# Altium schematic sheet Car.SchDoc: Car
size 431 x 279 mm; Date: Not shown in title block; ApprovedBy: Not shown in title block; CheckedBy: Not shown in title block; Author: Not shown in title block; CompanyName: Not shown in title block; Engineer: Not shown in title block; Organization: loganhartfordprojects.com; Revision: 0.1; PageSetup: Record=PageOptions|CenterHorizontal=True|CenterVertical=True|PrintScale=1.00|XCorrection=1.00|YCorrection=1.00|PrintKind=0|BorderSize=5000000|LeftOffset=0|BottomOffset=0|Orientation=2|PaperLength=1000|PaperWidth=1000|Scale=100|PaperSource=15|PrintQuality=600|MediaType=1|DitherType=10|PaperKind=Letter|PrintScaleMode=1; DocumentNumber: 1; SheetNumber: 1; SheetTotal: 1; CurrentTime: Not shown in title block; CurrentDate: Not shown in title block; Time: Not shown in title block; DocumentFullPathAndName: Not shown in title block; DocumentName: Not shown in title block; ModifiedDate: Not shown in title block; ImagePath: Not shown in title block
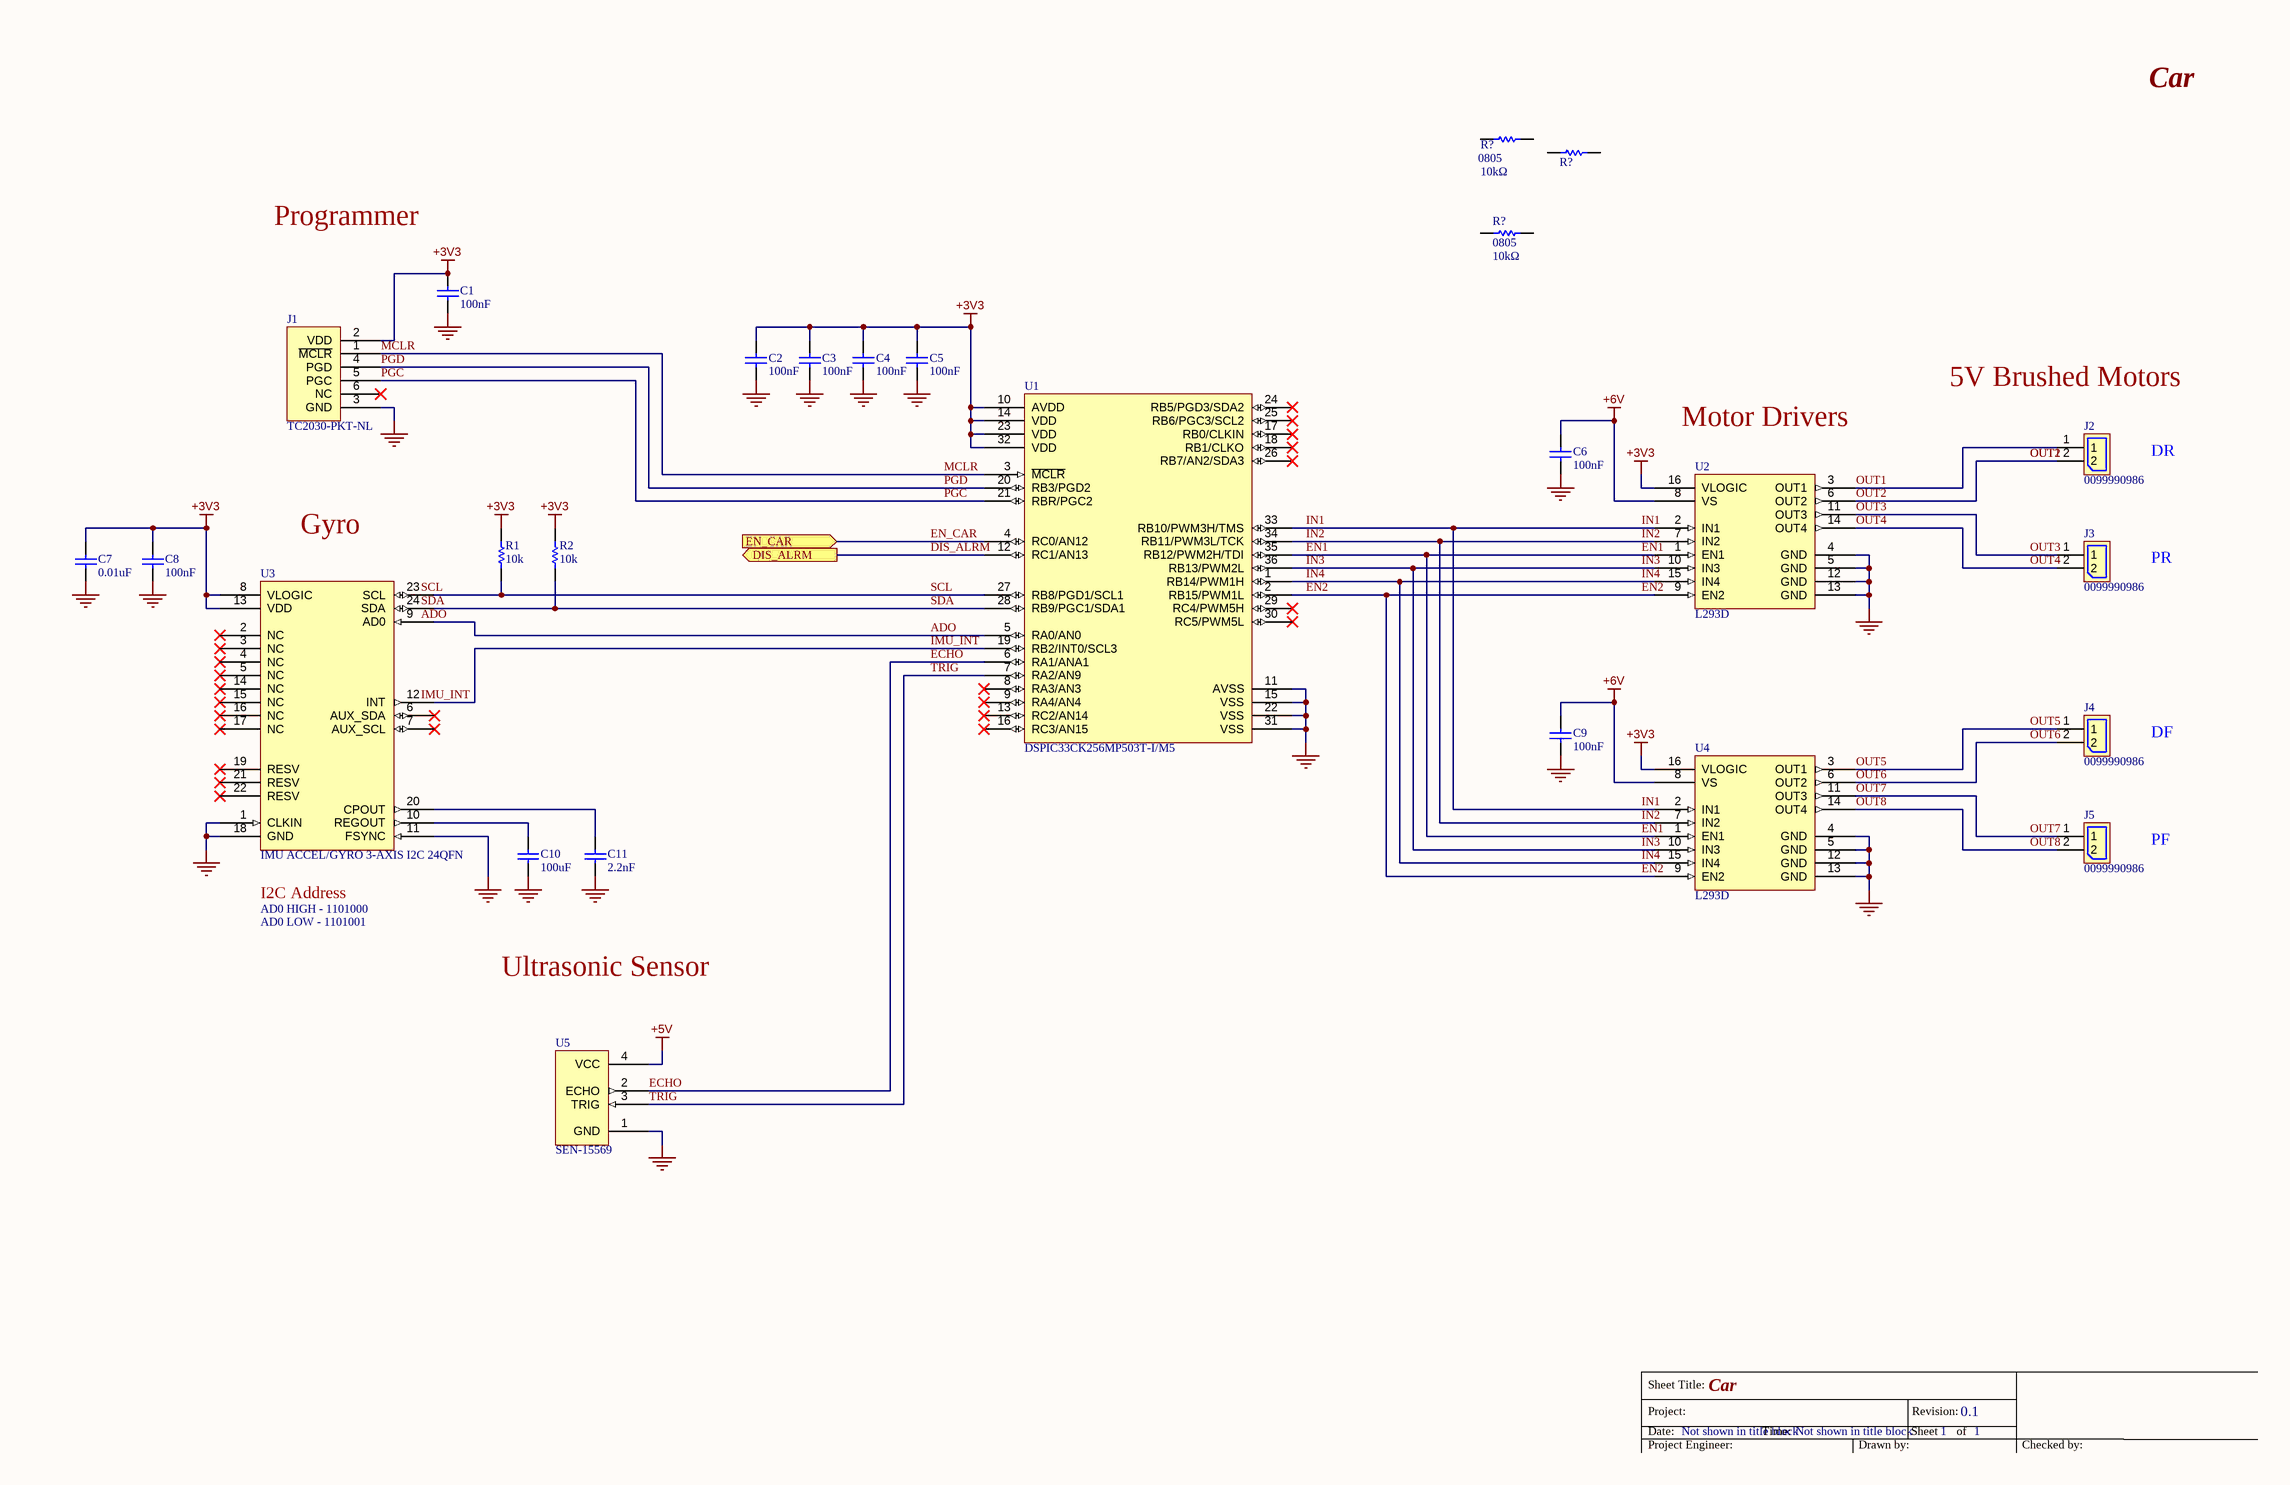
[diagram p0: Car.SchDoc]

## Parts
(Parts that share a designator on the sheet are numbered #1, #2 ... from top to bottom, then left to right.)
C1  100nF  [C0402]
C2  100nF  [C0402]
C3  100nF  [C0402]
C4  100nF  [C0402]
C5  100nF  [C0402]
C6  100nF  [C0402]
C7  0.01uF  [C0402]
C8  100nF  [C0402]
C9  100nF  [C0402]
C10  100uF  [C1206]
C11  2.2nF  [C0402]
J1  TC2030-PKT-NL  [TC2030-PKT-NL]
J2  0099990986  [0099990986]
J3  0099990986  [0099990986]
J4  0099990986  [0099990986]
J5  0099990986  [0099990986]
R1  10k  [RESC1005X04N]
R2  10k  [RESC1005X04N]
R?#1  Resistance: 10kΩ  Package: 0805  (hidden comment: Resistor)
R?#2  Resistor  (value not drawn)
R?#3  Package/F: 0805  Resistance: 10kΩ  (hidden comment: Resistor)
U1  DSPIC33CK256MP503T-I/M5
U2  L293D
U3  IMU ACCEL/GYRO 3-AXIS I2C 24QFN  [QFN50P395X395X95_HS-25N]
U4  L293D
U5  SEN-15569  [SEN-15569]

## Ports
DIS_ALRM (out), EN_CAR (in)

## Nets
+3V3: C1.2 C2.2 C3.2 C4.2 C5.2 C7.2 C8.2 J1.2(VDD) R1.2 R2.2 U1.10(AVDD) U1.14(VDD) U1.23(VDD) U1.32(VDD) U2.16(VLOGIC) U3.8(VLOGIC) U3.13(VDD) U4.16(VLOGIC)
+5V: U5.4(VCC)
+6V: C6.2 C9.2 U2.8(VS) U4.8(VS)
GND: C1.1 C2.1 C3.1 C4.1 C5.1 C6.1 C7.1 C8.1 C9.1 C10.1 C11.1 J1.3(GND) U1.11(AVSS) U1.15(VSS) U1.22(VSS) U1.31(VSS) U2.4(GND) U2.5(GND) U2.12(GND) U2.13(GND) U3.1(CLKIN) U3.11(FSYNC) U3.18(GND) U4.4(GND) U4.5(GND) U4.12(GND) U4.13(GND) U5.1(GND)
ADO: U1.5(RA0/AN0) U3.9(AD0)
DIS_ALRM: U1.12(RC1/AN13) ; port DIS_ALRM
ECHO: U1.6(RA1/ANA1) U5.2(ECHO)
EN1: U1.35(RB12/PWM2H/TDI) U2.1(EN1) U4.1(EN1)
EN2: U1.2(RB15/PWM1L) U2.9(EN2) U4.9(EN2)
EN_CAR: U1.4(RC0/AN12) ; port EN_CAR
IMU_INT: U1.19(RB2/INT0/SCL3) U3.12(INT)
IN1: U1.33(RB10/PWM3H/TMS) U2.2(IN1) U4.2(IN1)
IN2: U1.34(RB11/PWM3L/TCK) U2.7(IN2) U4.7(IN2)
IN3: U1.36(RB13/PWM2L) U2.10(IN3) U4.10(IN3)
IN4: U1.1(RB14/PWM1H) U2.15(IN4) U4.15(IN4)
MCLR: J1.1(~{MCLR}) U1.3(~{MCLR})
OUT1: J2.1 J2.2 U2.3(OUT1) U2.6(OUT2)  [also labelled OUT2]
OUT3: J3.1 U2.11(OUT3)
OUT4: J3.2 U2.14(OUT4)
OUT5: J4.1 U4.3(OUT1)
OUT6: J4.2 U4.6(OUT2)
OUT7: J5.1 U4.11(OUT3)
OUT8: J5.2 U4.14(OUT4)
PGC: J1.5(PGC) U1.21(RBR/PGC2)
PGD: J1.4(PGD) U1.20(RB3/PGD2)
SCL: R1.1 U1.27(RB8/PGD1/SCL1) U3.23(SCL)
SDA: R2.1 U1.28(RB9/PGC1/SDA1) U3.24(SDA)
TRIG: U1.7(RA2/AN9) U5.3(TRIG)
NetC10_2: C10.2 U3.10(REGOUT)
NetC11_2: C11.2 U3.20(CPOUT)

Not connected (* = marked no-connect by the designer): J1 6(NC)*; R?#1 1 2; R?#2 1 2; R?#3 1 2; U1 8(RA3/AN3)* 9(RA4/AN4)* 13(RC2/AN14)* 16(RC3/AN15)* 17(RB0/CLKIN)* 18(RB1/CLKO)* 24(RB5/PGD3/SDA2)* 25(RB6/PGC3/SCL2)* 26(RB7/AN2/SDA3)* 29(RC4/PWM5H)* 30(RC5/PWM5L)*; U3 2(NC)* 3(NC)* 4(NC)* 5(NC)* 6(AUX_SDA)* 7(AUX_SCL)* 14(NC)* 15(NC)* 16(NC)* 17(NC)* 19(RESV)* 21(RESV)* 22(RESV)*

## Notes on the sheet
- Programmer
- Motor Drivers
- 5V Brushed Motors
- DR
- Gyro
- PR
- DF
- (near U3) I2C Address
- PF
- AD0 HIGH - 1101000
- AD0 LOW - 1101001
- Ultrasonic Sensor
- Labels drawn without touching a wire or pin: ADO, IMU_INT, SCL, SDA
- Sheet Title:
- Date:
- Project:
- Time:
- Sheet
- Revision:
- of
- Project Engineer:
- Drawn by:
- Checked by:

## Library data of the parts
C1-C6 C9 = CL05A104KA5NNNC: Ceramic Capacitor, Multilayer, Ceramic, 25V, 10% +Tol, 10% -Tol, X5R, 15% TC, 0.1uF, Surface Mount, 0402; Manufacturer: Samsung; Part Number: CL05A104KA5NNNC; Supplier 1: Digi-Key; Supplier Part Number 1: 1276-1043-1-ND; Manufacturer Part Number: CL05A104KA5NNNC; Capacitance: 100nF
C7 = HMK105B7103KVHFE: Manufacturer: Taiyo Yuden; Part Number: HMK105B7103KVHFE; Supplier 1: Digi-Key; Supplier Part Number 1: 587-HMK105B7103KVHFECT-ND; Manufacturer Part Number: HMK105B7103KVHFE; Capacitance: 0.01uF
C8 = CL05A104KP5NNNC: Cap Ceramic 0.1uF 10V X5R 10% SMD 0402 85C Paper T/R; Manufacturer: Samsung; Part Number: CL05A104KP5NNNC; Supplier 1: Digi-Key; Supplier Part Number 1: 1276-1022-1-ND; Manufacturer Part Number: CL05A104KP5NNNC; Stock 1: 2170577; Pricing 1: 1=0.1, 10=0.011, 100=0.0047, 500=0.0033, 1000=0.0026, 2500=0.0024, 5000=0.0022 (USD); Mount: Surface Mount; Case/Package: 0402; Case Code (Metric): 1005; Case Code (Imperial): 0402; Contact Plating: Tin; Min Operating Temperature: -55°C; Max Operating Temperature: 85°C; Capacitance: 100nF; Tolerance: 10%; Dielectric: X5R; Packaging: Tape and Reel; Voltage Rating: 10V; Length: 1mm; Height: 0.5mm; Width: 0.02inch; Thickness: 0.022inch; Depth: 0.5mm; Radiation Hardening: No
C10 = CL31A107MQHNNNE: Cap Ceramic 100uF 6.3V X5R 20% SMD 1206 85C T/R; Manufacturer: Samsung; Part Number: CL31A107MQHNNNE; Supplier 1: Digi-Key; Supplier Part Number 1: 1276-1782-1-ND; Manufacturer Part Number: CL31A107MQHNNNE; Stock 1: 3572; Pricing 1: 1=0.56, 10=0.396, 100=0.261, 500=0.1933, 1000=0.1643 (USD); Mount: Surface Mount; Case/Package: 1206; Case Code (Metric): 3216; Case Code (Imperial): 1206; Contact Plating: Tin; Min Operating Temperature: -55°C; Max Operating Temperature: 85°C; Capacitance: 100uF; Tolerance: 20%; Dielectric: X5R; Packaging: Tape and Reel; Voltage Rating: 6.3V; Length: 3.2mm; Height: 1.6mm; Width: 0.063inch; Thickness: 0.071inch; Depth: 1.6mm; Radiation Hardening: No
C11 = C0402C222J3GEC7867: CAP CER 0402 2.2NF 25V C0G 5%; Manufacturer: KEMET; Part Number: C0402C222J3GEC7867; Supplier 1: Digi-Key; Supplier Part Number 1: 399-C0402C222J3GEC7867CT-ND; Manufacturer Part Number: C0402C222J3GEC7867; Stock 1: 6454; Pricing 1: 1=0.17000, 10=0.12300, 50=0.07000, 100=0.05800, 500=0.04068, 1000=0.03368, 2500=0.03135, 5000=0.02868 (USD); Capacitance: 2.2nF; RoHS: No; Category: Ceramic Capacitors
J1 = TC2030-PKT-NL: Pogo pin cable for PicKit 3; Part Number: TC2030-PKT-NL
J2-J5 = 0099990986: Board Connector, 2 Contact(s), 1 Row(s), Male, Straight, 0.098 inch Pitch, Solder Terminal, Locking, Receptacle; Manufacturer: Molex; Insulation Resistance: 1GR; Number of Contacts: 2; Contact Resistance: 20mR; Part Number: 0099990986; Supplier 1: Digi-Key; Supplier Part Number 1: WM4271-ND; Manufacturer Part Number: 99-99-0986; Min Operating Temperature: -40°C; Max Operating Temperature: 105°C; Termination: Solder; Flammability Rating: UL94 V-0; ComponentLink1URL: https://datasheet.ciiva.com:443/pdfs/VipMasterIC/IC/MOLE/MOLES56051/MOLES56051-1.pdf?src-supplier=IHS+Markit; ComponentLink1Description: https://datasheet.ciiva.com:443/pdfs/VipMasterIC/IC/MOLE/MOLES56051/MOLES56051-1.pdf?src-supplier=IHS+Markit; Mount: Board; REACH SVHC: Yes; ComponentLink2URL: https://datasheet.ciiva.com/738/099990989-sd-738043.pdf?src-supplier=Digi-Key; ComponentLink2Description: https://datasheet.ciiva.com/738/099990989-sd-738043.pdf?src-supplier=Digi-Key; ComponentLink3URL: https://datasheet.ciiva.com/11747/0900766b80dc7cb9-11747620.pdf?src-supplier=RSComponents; ComponentLink3Description: https://datasheet.ciiva.com/11747/0900766b80dc7cb9-11747620.pdf?src-supplier=RSComponents; Connector Type: BOARD CONNECTOR
R1 R2 = RC0402FR-0710KL: RES SMD 10K OHM 1% 1/16W 0402; Manufacturer: Yageo; Power Rating: 62.5mW; Voltage Rating: 50V; Temperature Coefficient: 100ppm/°C; Part Number: RC0402FR-0710KL; Value: 10k; Supplier 1: Digi-Key; Supplier Part Number 1: 311-10.0KLRCT-ND; Manufacturer Part Number: RC0402FR-0710KL; Stock 1: 14034353; Pricing 1: 1=0.1, 10=0.014, 100=0.0056, 1000=0.0025, 2500=0.0022, 5000=0.0018 (USD); Case/Package: 0402; Case Code (Metric): 1005; Case Code (Imperial): 0402; Min Operating Temperature: -55°C; Max Operating Temperature: 155°C; Packaging: Tape and Reel; Tolerance: 1%; Composition: Thick Film; Resistance: 10k; Military Standard: Not; Length: 1mm; Height: 0.32mm; Width: 0.5mm; Depth: 0.5mm; Lead Pitch: 0.2mm; REACH SVHC: No SVHC; Lead Free: Lead Free; ComponentLink1URL: https://datasheet.ciiva.com/7660/38568-7660787.pdf; ComponentLink1Description: https://datasheet.ciiva.com/7660/38568-7660787.pdf; ComponentLink2URL: https://datasheet.ciiva.com/7849/1784430-7849813.pdf; ComponentLink2Description: https://datasheet.ciiva.com/7849/1784430-7849813.pdf; ComponentLink3URL: https://datasheet.ciiva.com/11808/0900766b80c66297-11808309.pdf; ComponentLink3Description: https://datasheet.ciiva.com/11808/0900766b80c66297-11808309.pdf; ComponentLink4URL: https://datasheet.ciiva.com/16744/pyu-rc0402-51-rohs-l-6-r-16744005.pdf; ComponentLink4Description: https://datasheet.ciiva.com/16744/pyu-rc0402-51-rohs-l-6-r-16744005.pdf; ComponentLink5URL: https://datasheet.ciiva.com/7849/1686128-7849814.pdf; ComponentLink5Description: https://datasheet.ciiva.com/7849/1686128-7849814.pdf; ComponentLink6URL: https://datasheet.ciiva.com/7849/1784430-7849815.pdf; ComponentLink6Description: https://datasheet.ciiva.com/7849/1784430-7849815.pdf; ComponentLink7URL: https://datasheet.ciiva.com/22747/1018594-22747512.pdf; ComponentLink7Description: https://datasheet.ciiva.com/22747/1018594-22747512.pdf; ComponentLink8URL: https://datasheet.ciiva.com/12667/pyu-rc0402-51-rohs-l-6-r-12667067.pdf; ComponentLink8Description: https://datasheet.ciiva.com/12667/pyu-rc0402-51-rohs-l-6-r-12667067.pdf; ComponentLink9URL: https://datasheet.ciiva.com/7983/1018594-7983486.pdf; ComponentLink9Description: https://datasheet.ciiva.com/7983/1018594-7983486.pdf
R?#1 R?#3 = RC0805JR-0710KL: Manufacturer: Yageo; Part Number: RC0805JR-0710KL; Supplier: Digi-Key; Supplier Part Number: 311-10KARTR-ND
  R?#3: Package: 0805
R?#2 = RC0805JR-0710KL: Manufacturer: Yageo; Resistance: 10kΩ; Part Number: RC0805JR-0710KL; Supplier: Digi-Key; Supplier Part Number: 311-10KARTR-ND; Package: 0805
U2 U4 = L293D: Bipolar Motor Driver - Parallel 16-PowerDIP
U3 = MPU-6050: GYROSCOPE/ACCELEROMETER, MEMS, 3AXIS, QFN-24; MEMS Module Function:Tri-Axis Gyroscope, Tri-Axis Accelerometer; Supply Voltage Min:2.375V; Supply Voltage Max:3.46V; Sensor Case Style:QFN; No. of Pins:8; Packaging:Cut Tape; MSL:- ;RoHS Compliant: Yes; Manufacturer: TDK InvenSense; Sensor Type: Accelerometer,Gyroscope,3 Axis; Part Number: MPU-6050; Supplier 1: Digi-Key; Supplier Part Number 1: 1428-1007-1-ND; Manufacturer Part Number: MPU-6050; Mount: Surface Mount; RoHS: Yes; Stock 1: 86; Pricing 1: 1=11.77000, 5=7.64400, 10=6.88000, 25=6.11600, 50=5.65720, 100=4.89280, 500=4.58700, 1000=4.28120 (USD); Category: Inertial Measurement Units (IMUs); Min Operating Temperature: -40°C; Max Operating Temperature: 85°C; Series: -; Packaging: Tape and Reel; Output Type: I2C; ComponentLink1URL: https://datasheet.ciiva.com/1513/1788002-1513632.pdf?src-supplier=Element14; ComponentLink1Description: https://datasheet.ciiva.com/1513/1788002-1513632.pdf?src-supplier=Element14; ComponentLink2URL: https://datasheet.ciiva.com/22731/1788002-22731434.pdf?src-supplier=Element14; ComponentLink2Description: https://datasheet.ciiva.com/22731/1788002-22731434.pdf?src-supplier=Element14; Case/Package: QFN; RoHS Compliant: Yes
U5 = SEN-15569: HC-SR04 series Ultrasonic Sensor Evaluation Board; Manufacturer: SparkFun; Part Number: SEN-15569; Supplier 1: Digi-Key; Supplier Part Number 1: 1568-SEN-15569-ND; Manufacturer Part Number: SEN-15569; RoHS: No; Stock 1: 585; Pricing 1: 1=3.95000 (USD)